# Altium schematic sheet 0185_PG3 LOGIC.SchDoc
size 848 x 558 mm
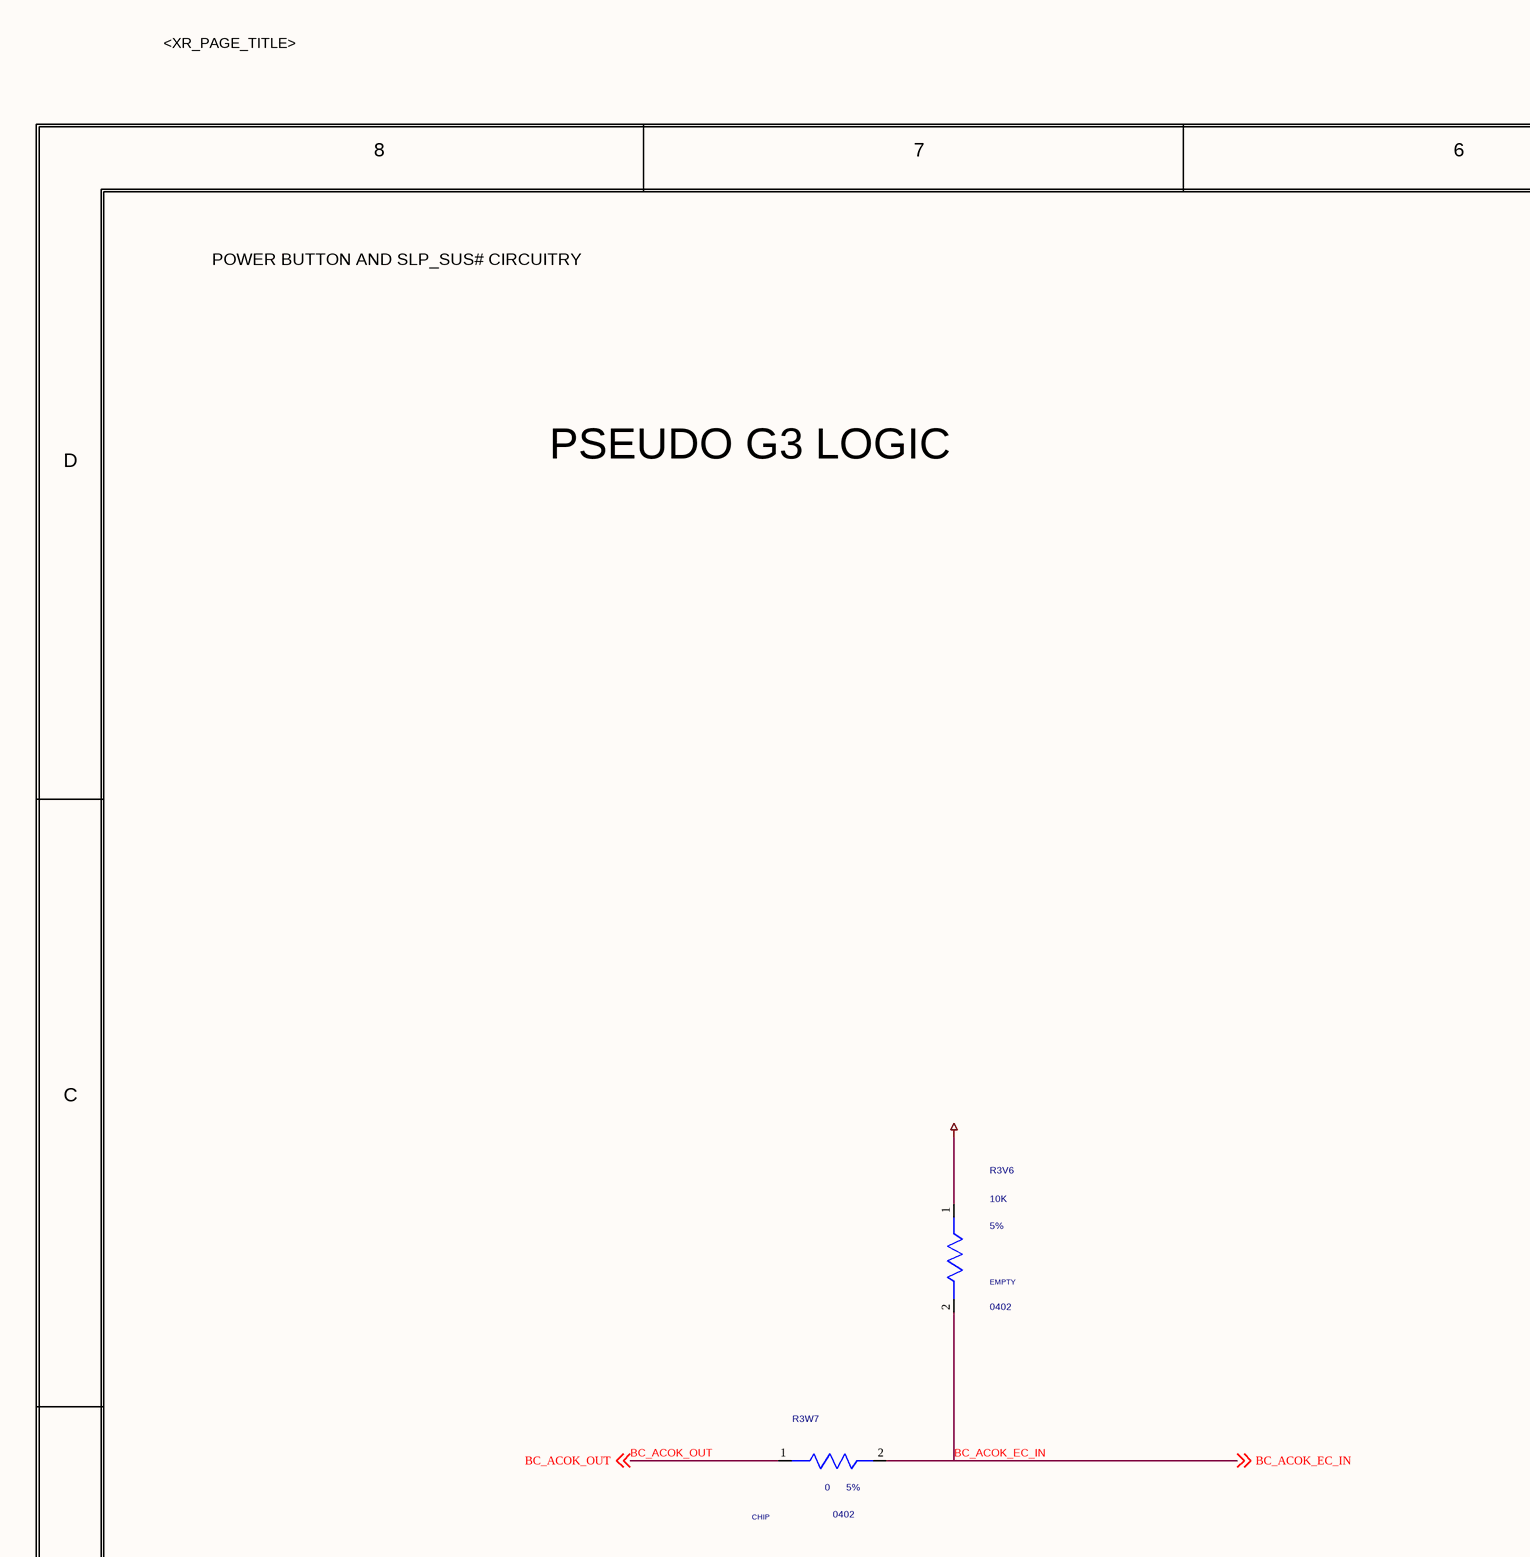
[diagram p0: 0185_PG3 LOGIC.SchDoc, top left]
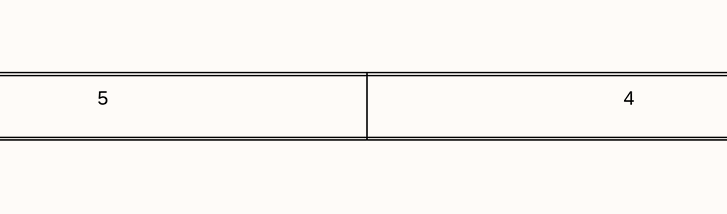
[diagram p1: 0185_PG3 LOGIC.SchDoc, top middle]
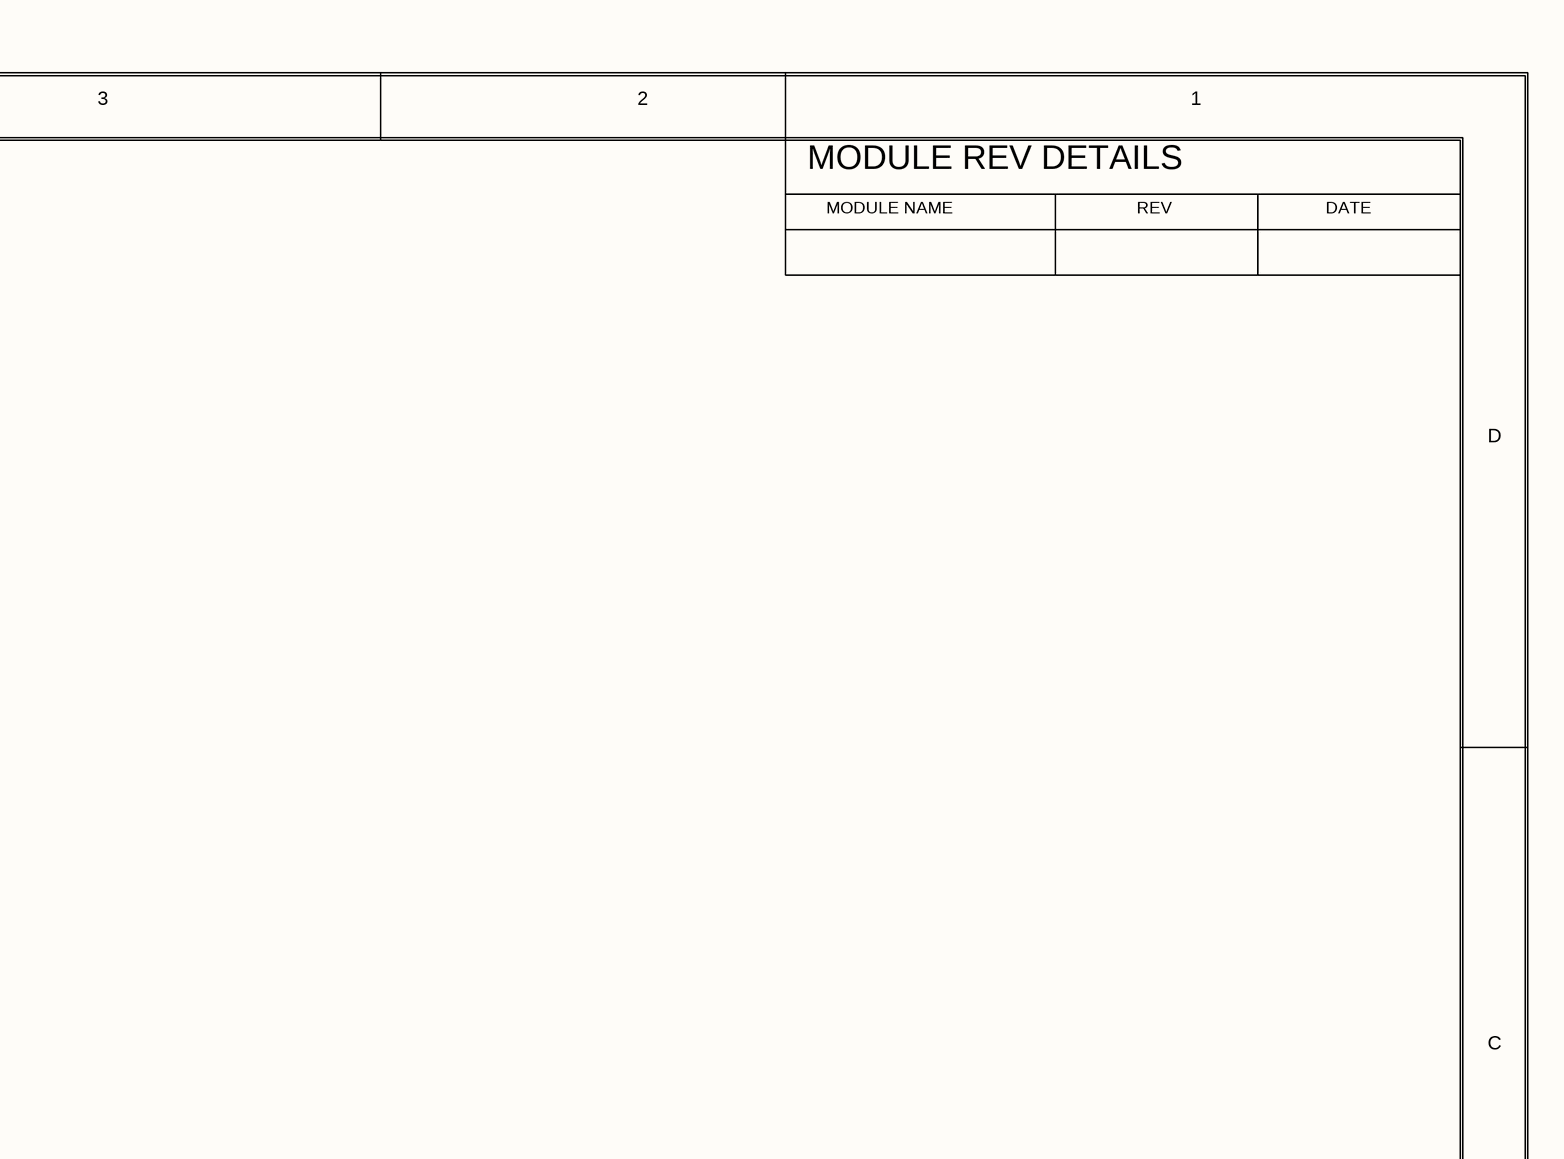
[diagram p2: 0185_PG3 LOGIC.SchDoc, top right]
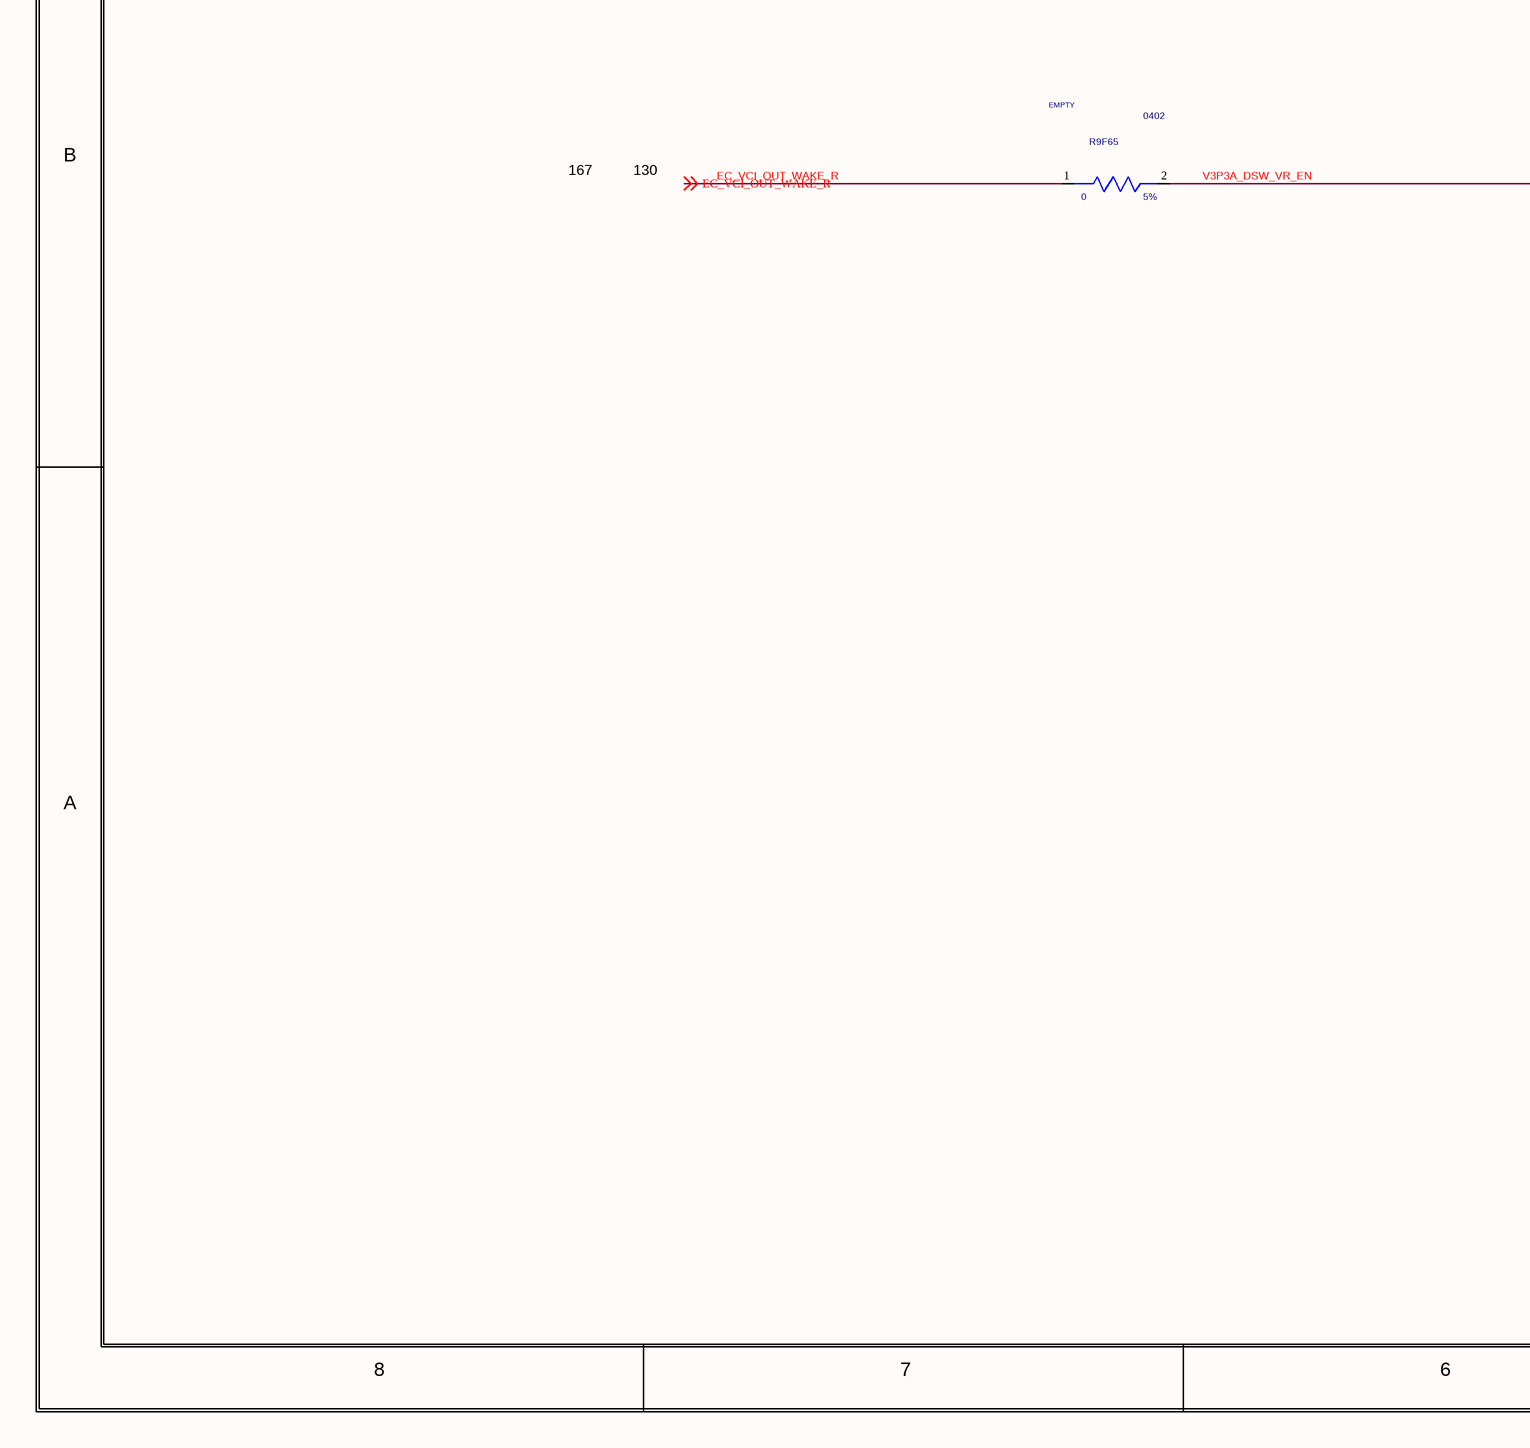
[diagram p3: 0185_PG3 LOGIC.SchDoc, bottom left]
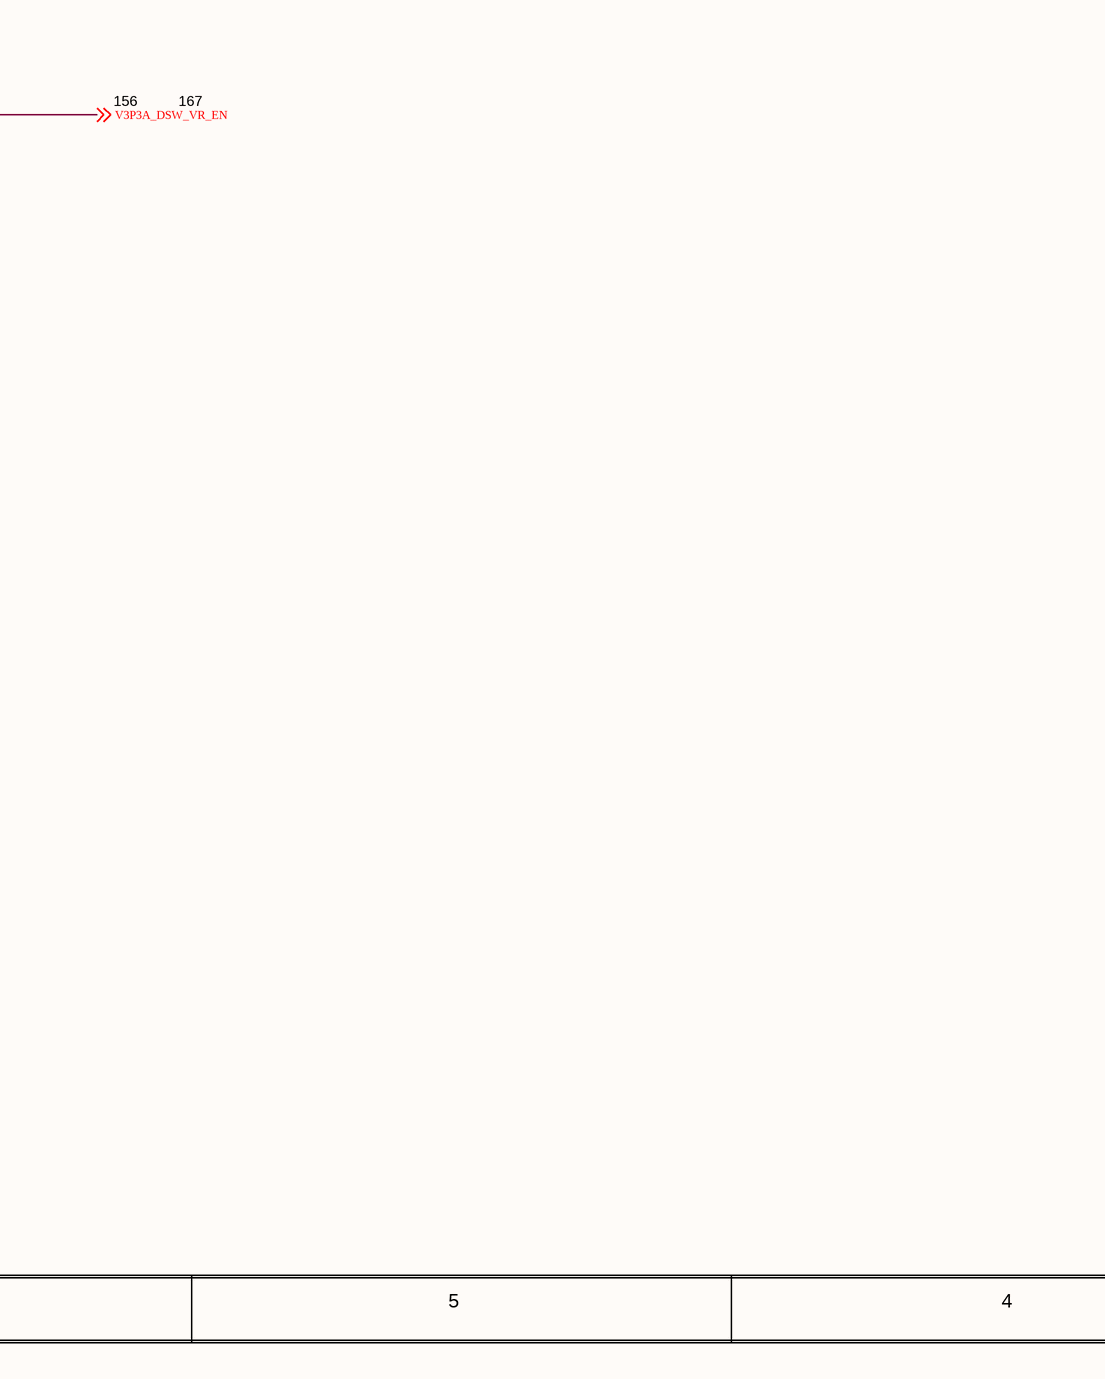
[diagram p4: 0185_PG3 LOGIC.SchDoc, bottom middle]
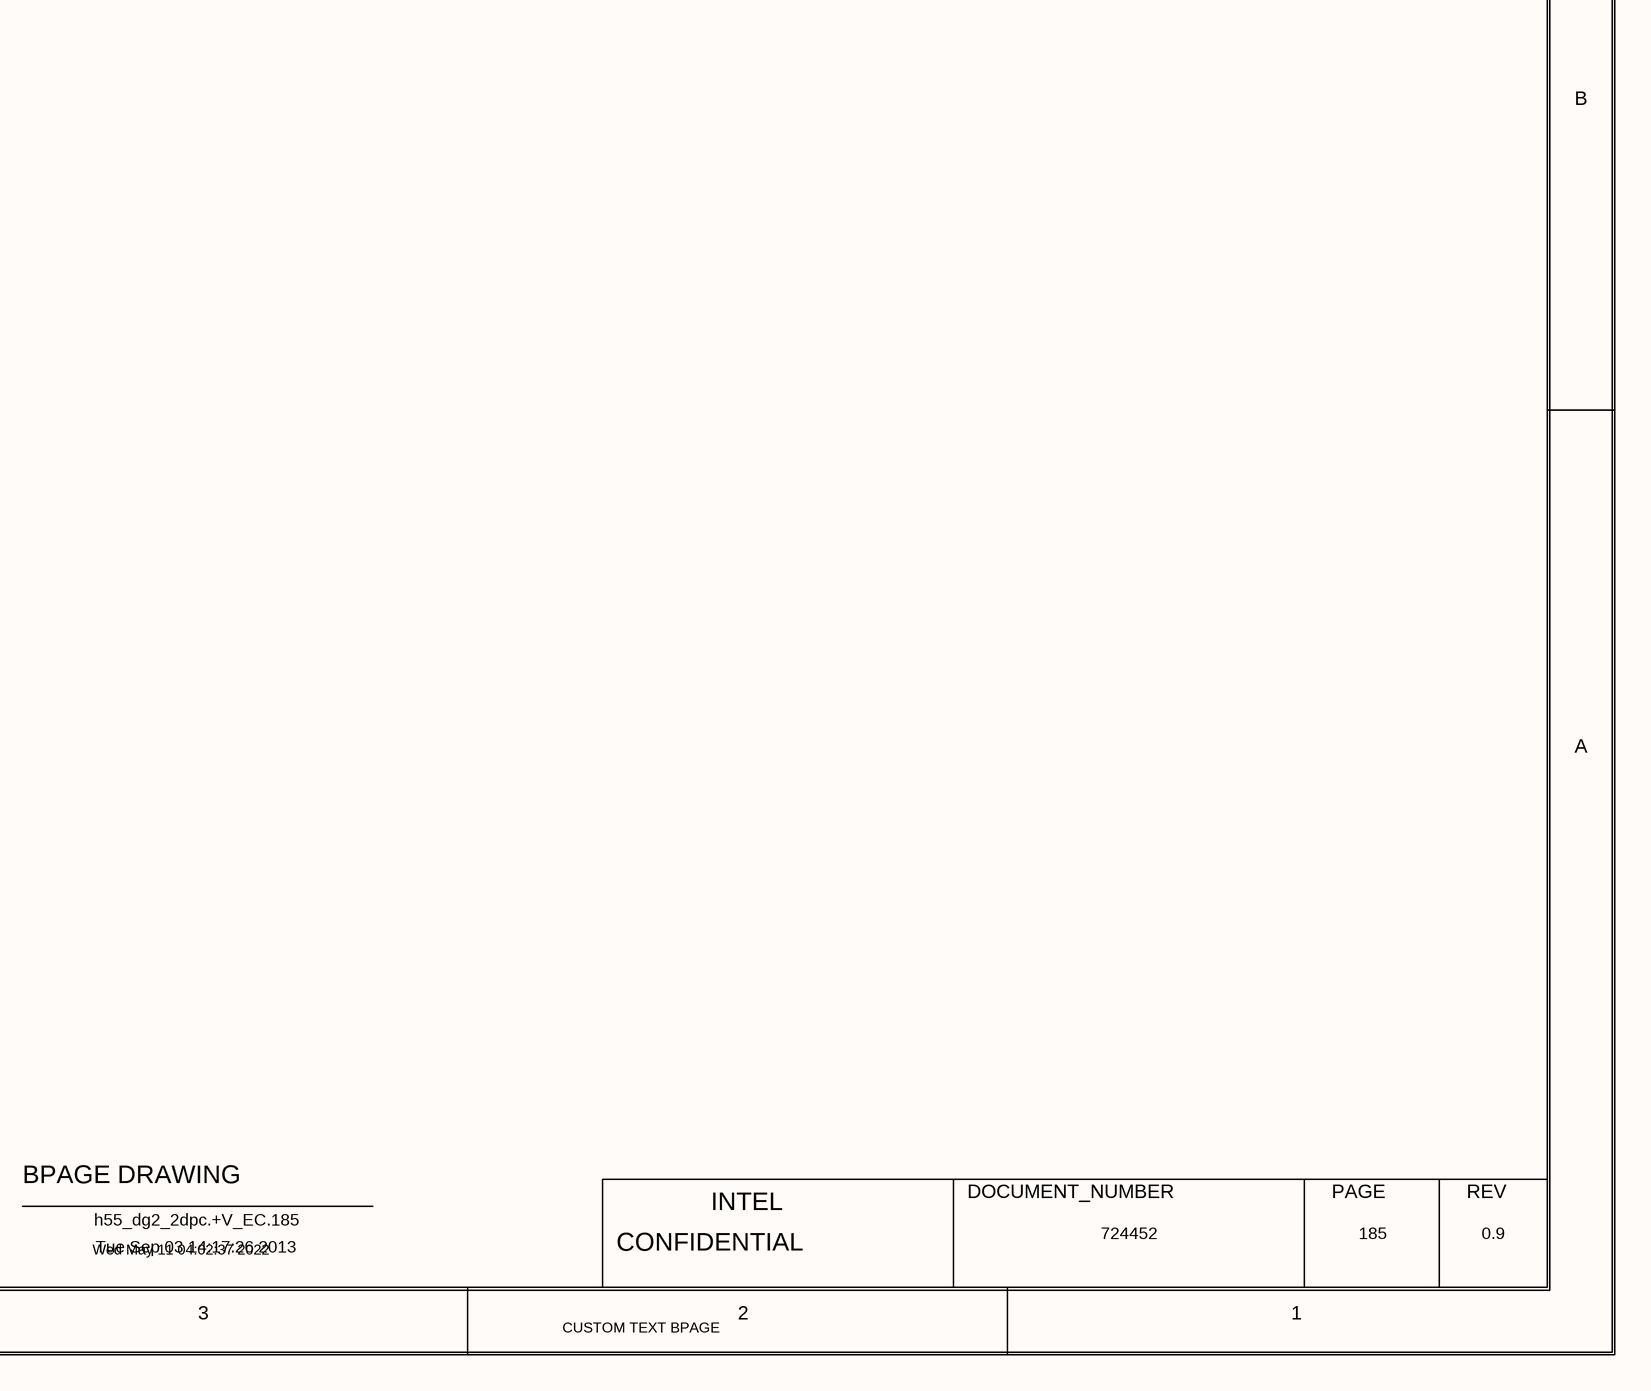
[diagram p5: 0185_PG3 LOGIC.SchDoc, bottom right]

## Parts
R3V6  10K  MATERIAL: EMPTY  PACK_TYPE: 0402  TOLERANCE: 5%  [SMR0402IA]
R3W7  0  MATERIAL: CHIP  PACK_TYPE: 0402  TOLERANCE: 5%  [SMR0402IA]
R9F65  0  MATERIAL: EMPTY  PACK_TYPE: 0402  TOLERANCE: 5%  [SMR0402IA]

## Nets
+V_EC_VBAT: R3V6.1(A)
BC_ACOK_EC_IN: R3V6.2(B) R3W7.2(B) ; off-sheet BC_ACOK_EC_IN
BC_ACOK_OUT: R3W7.1(A) ; off-sheet BC_ACOK_OUT
EC_VCI_OUT_WAKE_R: R9F65.1(A) ; off-sheet EC_VCI_OUT_WAKE_R
V3P3A_DSW_VR_EN: R9F65.2(B) ; off-sheet V3P3A_DSW_VR_EN

## Notes on the sheet
- <XR_PAGE_TITLE>
- 8
- 7
- 6
- 5
- 4
- 3
- 2
- 1
- MODULE REV DETAILS
- POWER BUTTON AND SLP_SUS# CIRCUITRY
- MODULE NAME
- REV
- DATE
- D
- PSEUDO G3 LOGIC
- C
- B
- 167
- 130
- 156
- A
- BPAGE DRAWING
- INTEL
- DOCUMENT_NUMBER
- PAGE
- Wed May 11 04:02:37 2022
- h55_dg2_2dpc.+V_EC.185
- Tue Sep 03 14:17:26 2013
- CONFIDENTIAL
- 724452
- 185
- 0.9
- CUSTOM TEXT BPAGE

## Library data of the parts
R3V6 = RES: PART_NUMBER: A93549-023; CDS_PHYS_PART_NAME: RES_0402-A93549-023,EMPTY,10K,5%,1/16W,LPDB,GENERIC; WATTAGE: 1/16W; OriginalSymbolOrigin: (-25,75); XY: (-3050,2025); VER: 2; ROT: 0; ROOM: ROOM_PROP_TEST_259; PHYS_PAGE: 185; LOCATION: R3V6; IP: GENERIC; FP_TECH: LPDB; DRAWING: @RVP1_ADL_SB_ADP_S_DDR5_SODIMM_2DPC_LIB.H55_DG2_2DPC(SCH_1):PAGE554; CDS_LIB: discrete; PCB Footprint: SMR0402IA; CHIPS_PART_NAME: RES; CDS_PART_NAME: RES_0402-A93549-023,EMPTY,10K,5%,1/16W,LPDB,GENERIC; CDS_LOCATION: R3V6
R3W7 = RES#1: PART_NUMBER: A93549-001; CHIPS_PART_NAME: RES; CDS_PHYS_PART_NAME: RES_0402-A93549-001,CHIP,0,5%,1/16W,LPDB,GENERIC; WATTAGE: 1/16W; OriginalSymbolOrigin: (-75,25); XY: (-3275,1650); VER: 1; ROOM: ROOM_PROP_TEST_259; PHYS_PAGE: 185; LOCATION: R3W7; DRAWING: @RVP1_ADL_SB_ADP_S_DDR5_SODIMM_2DPC_LIB.H55_DG2_2DPC(SCH_1):PAGE554; CDS_LIB: discrete; PCB Footprint: SMR0402IA; ROT: 0; CDS_PART_NAME: RES_0402-A93549-001,CHIP,0,5%,1/16W,LPDB,GENERIC; CDS_LOCATION: R3W7
R9F65 = RES#1: PART_NUMBER: A93549-001; CHIPS_PART_NAME: RES; CDS_PHYS_PART_NAME: RES_0402-A93549-001,EMPTY,0,5%,1/16W,LPDB,GENERIC; WATTAGE: 1/16W; OriginalSymbolOrigin: (-75,25); XY: (-2750,1150); VER: 1; ROOM: ROOM_PROP_TEST_259; PHYS_PAGE: 185; LOCATION: R9F65; IP: GENERIC; FP_TECH: LPDB; DRAWING: @RVP1_ADL_SB_ADP_S_DDR5_SODIMM_2DPC_LIB.H55_DG2_2DPC(SCH_1):PAGE554; CDS_LIB: discrete; PCB Footprint: SMR0402IA; ROT: 0; CDS_PART_NAME: RES_0402-A93549-001,EMPTY,0,5%,1/16W,LPDB,GENERIC; CDS_LOCATION: R9F65